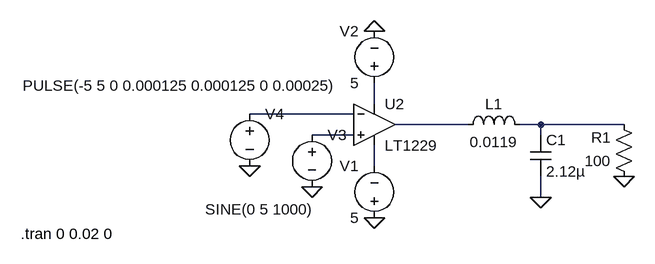
[diagram p0: schematic lab_3_50k_1k.asc]
lab_3_50k_1k.asc, the LTspice schematic file:
Version 4
SHEET 1 880 680
WIRE 176 112 176 80
WIRE 144 128 -16 128
WIRE 320 144 208 144
WIRE 432 144 400 144
WIRE 560 144 432 144
WIRE 144 160 80 160
WIRE 432 160 432 144
WIRE 176 208 176 176
WIRE 432 256 432 224
FLAG 176 288 0
FLAG 176 0 0
FLAG -16 208 0
FLAG 80 240 0
FLAG 432 256 0
FLAG 560 224 0
SYMBOL voltage 176 304 R180
WINDOW 0 24 96 Left 2
WINDOW 3 24 16 Left 2
WINDOW 123 0 0 Left 0
WINDOW 39 0 0 Left 0
SYMATTR InstName V1
SYMATTR Value 5
SYMBOL voltage 176 96 R180
WINDOW 0 24 96 Left 2
WINDOW 3 24 16 Left 2
WINDOW 123 0 0 Left 0
WINDOW 39 0 0 Left 0
SYMATTR InstName V2
SYMATTR Value 5
SYMBOL voltage 80 144 R0
WINDOW 3 -164 131 Left 2
WINDOW 123 0 0 Left 0
WINDOW 39 0 0 Left 0
SYMATTR Value SINE(0 5 1000)
SYMATTR InstName V3
SYMBOL voltage -16 112 R0
WINDOW 3 -349 -28 Left 2
WINDOW 123 0 0 Left 0
WINDOW 39 0 0 Left 0
SYMATTR Value PULSE(-5 5 0 0.000125 0.000125 0 0.00025)
SYMATTR InstName V4
SYMBOL res 576 240 R180
WINDOW 0 36 76 Left 2
WINDOW 3 36 40 Left 2
SYMATTR InstName R1
SYMATTR Value 100
SYMBOL OpAmps\\LT1229 176 80 R0
SYMATTR InstName U2
SYMBOL cap 416 160 R0
SYMATTR InstName C1
SYMATTR Value 2.12µ
SYMBOL ind 304 160 R270
WINDOW 0 32 56 VTop 2
WINDOW 3 5 56 VBottom 2
SYMATTR InstName L1
SYMATTR Value 0.0119
TEXT -368 312 Left 2 !.tran 0 0.02 0

The netlist it stands for:
* lab_3_50k_1k.asc
V1 0 N006 5
V2 N001 0 5
V3 N005 0 SINE(0 5 1000)
V4 N002 0 PULSE(-5 5 0 0.000125 0.000125 0 0.00025)
R1 0 N004 100
XU2 N005 N002 N001 N006 N003 LT1229  ; pins In+ In- V+ V- OUT
C1 N004 0 2.12µ
L1 N003 N004 0.0119
.tran 0 0.02 0
.backanno
.end